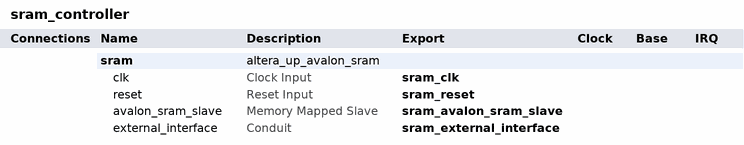
[diagram p0: system contents]
# Platform Designer (Qsys) system sram_controller, Cyclone IV E EP4CE115F29C7
# Parameters at their usual value, and those the tool derives, are not listed.
package require -exact qsys 18.0
create_system sram_controller
set_project_property DEVICE_FAMILY {Cyclone IV E}
set_project_property DEVICE EP4CE115F29C7

add_instance sram altera_up_avalon_sram 18.0
set_instance_parameter_value sram board DE2-115
set_instance_parameter_value sram pixel_buffer false

# exported interfaces
add_interface sram_avalon_sram_slave avalon slave
set_interface_property sram_avalon_sram_slave EXPORT_OF sram.avalon_sram_slave
add_interface sram_clk clock sink
set_interface_property sram_clk EXPORT_OF sram.clk
add_interface sram_external_interface conduit end
set_interface_property sram_external_interface EXPORT_OF sram.external_interface
add_interface sram_reset reset sink
set_interface_property sram_reset EXPORT_OF sram.reset

set_interconnect_requirement {$system} qsys_mm.clockCrossingAdapter HANDSHAKE
set_interconnect_requirement {$system} qsys_mm.enableEccProtection FALSE
set_interconnect_requirement {$system} qsys_mm.insertDefaultSlave FALSE
set_interconnect_requirement {$system} qsys_mm.maxAdditionalLatency 1

save_system sram_controller.qsys
